# EAGLE design base-pcb (EAGLE 6.4)
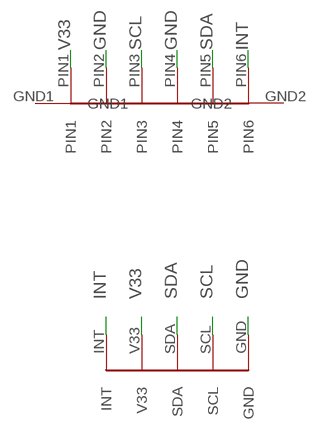
[diagram p0: schematic, sheet 1]

## Parts
POGO-1  POGOPINS  [POGOPINS]
U$1  6PCONNECTOR  [6PCONNECTOR]

## Nets
GND: POGO-1.GND U$1.PIN2 U$1.PIN4
INT: POGO-1.INT U$1.PIN6
SCL: POGO-1.SCL U$1.PIN3
SDA: POGO-1.SDA U$1.PIN5
V33: POGO-1.V33 U$1.PIN1
Unconnected: U$1.GND1 U$1.GND2

## Library data of the parts
POGO-1 = pogopins:POGOPINS
U$1 = 6Pconnector:6PCONNECTOR

## Board
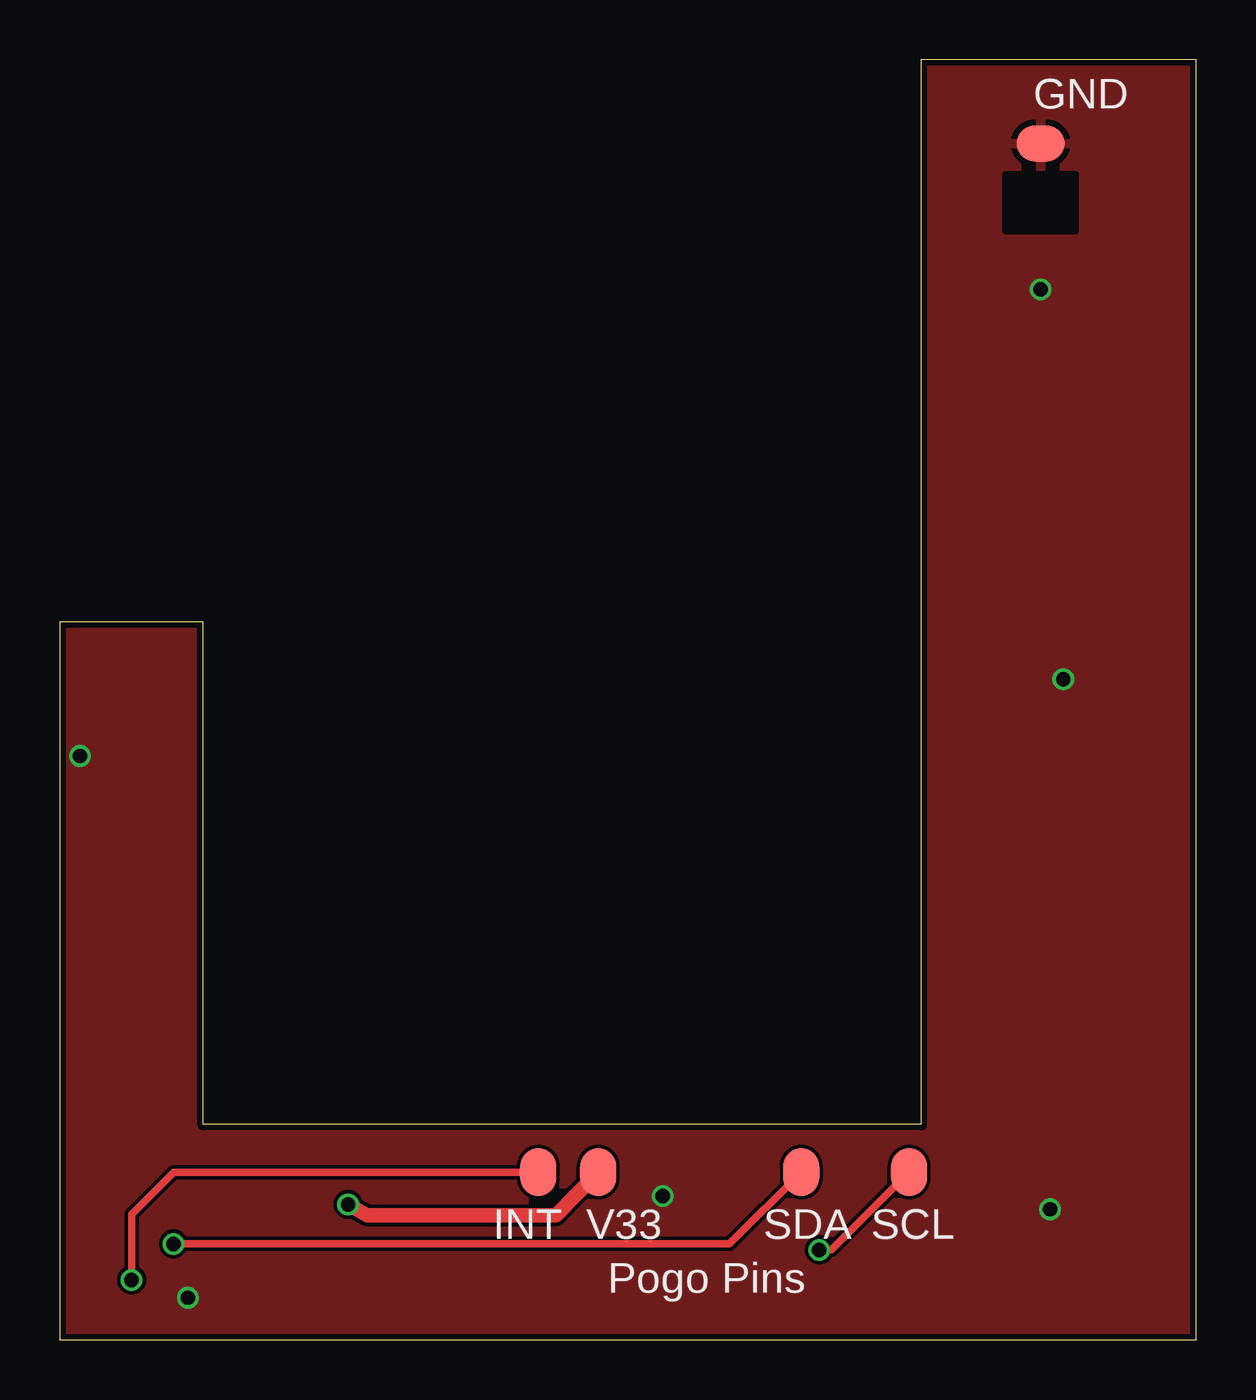
[diagram p1: board, top side]
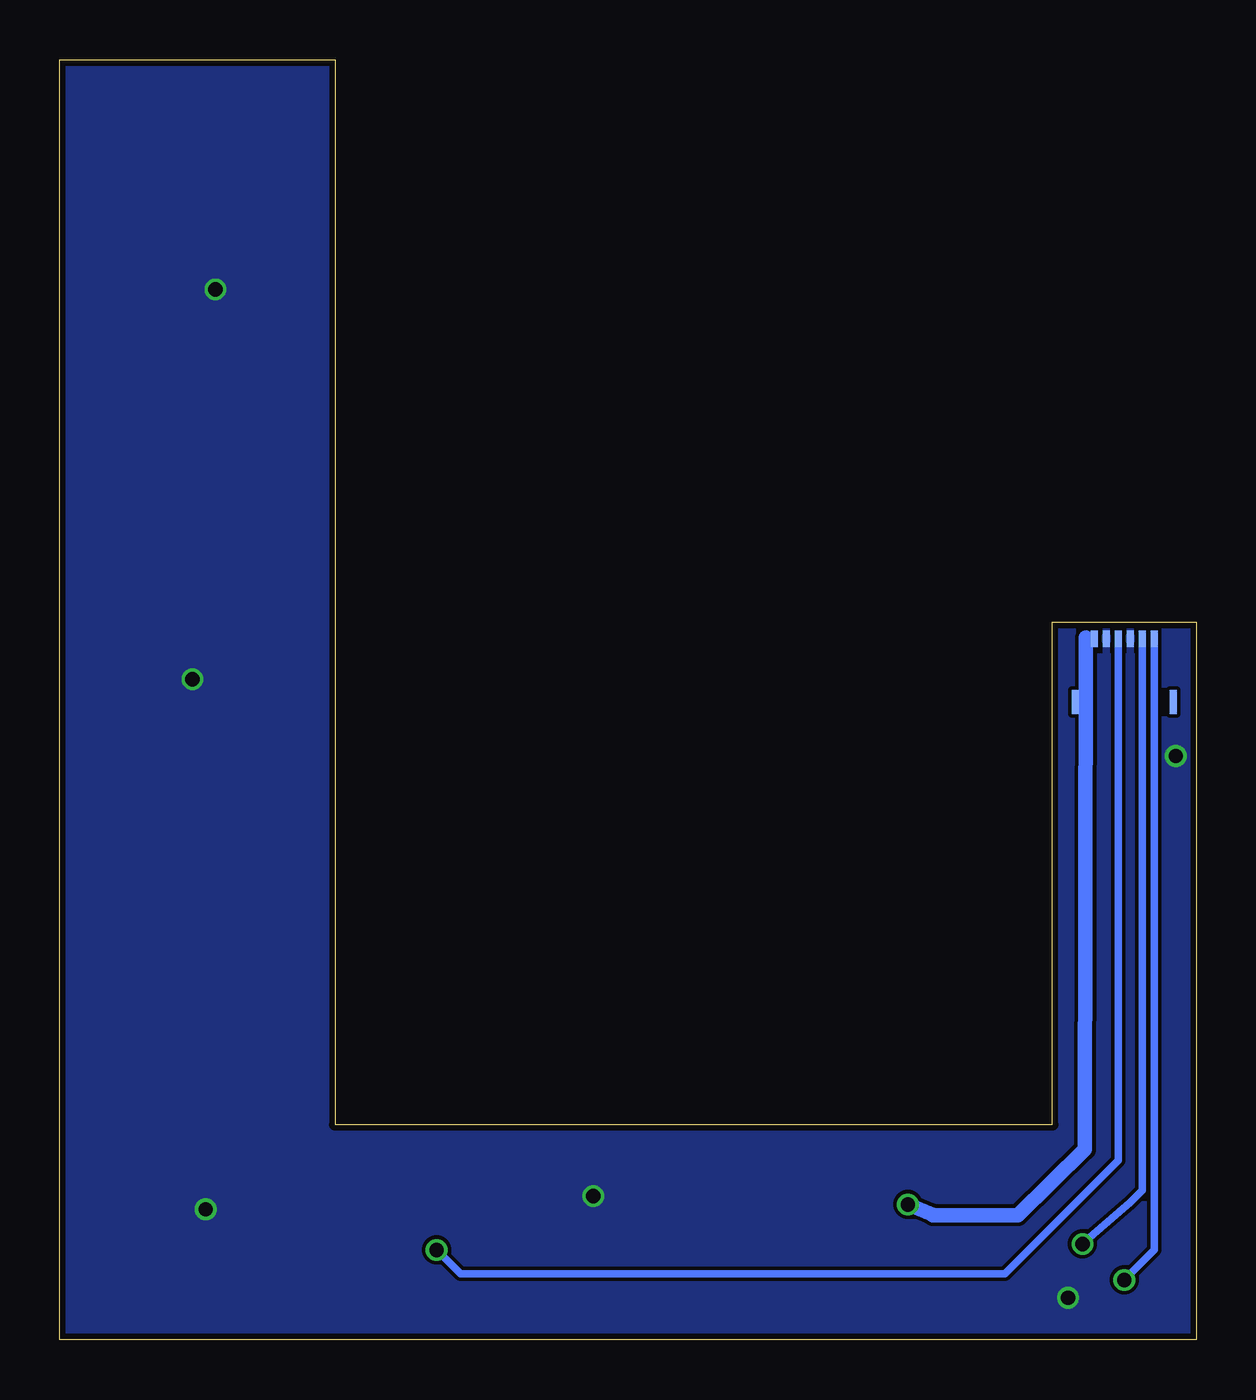
[diagram p2: board, bottom side, seen from below]

Size 47.5 x 53.5 mm. Coordinates in mm from the lower left corner, seen from the top.
Outline: 0,0 47.5,0 47.5,53.5 36,53.5 36,9 6,9 6,30 0,30 0,0
Copper layers (1*2*15*16): Top 0.035mm / dielectric 0.2mm / Route2 0.0175mm / dielectric 1.1mm / Route15 0.0175mm / dielectric 0.2mm / Bottom 0.035mm
Design rules "SeeedStudio_DRU_no_angle_20130527": minimum track width 6mil, minimum drill 12mil, track to track 6mil, track to pad 6mil, pad to pad 6mil, via to via 6mil, smd to smd 0mil, copper to edge 10mil, drill to drill 10mil, minimum pad ring 6mil, minimum via ring 6mil, stop-mask expansion 2mil, vias tented up to drill 25mil, thermal gap 10mil

### Footprints (pad centres in the part's own frame; a part is rotated, then mirrored left to right if it is on the bottom)
POGOPINS = smd 2 x 1.5: GND 13,43 | smd 1.5 x 2: INT -8,0; SCL 7.5,0; SDA 3,0; V33 -5.5,0
6PCONNECTOR = smd 0.3 x 1: GND1 -2.05,-2.3; GND2 2.05,-2.3 | smd 0.3 x 0.7: PIN1 -1.25,0.35; PIN2 -0.75,0.35; PIN3 -0.25,0.35; PIN4 0.25,0.35; PIN5 0.75,0.35; PIN6 1.25,0.35

### Placement (x,y rotation side)
POGO-1  28,7 0 top
U$1  3,28.95 0 bottom

### Tracks (layer width: path | path; a pad name or v marks a point on that pad's centre or on a via)
GND  (via drill 0.6)
  other vias: 41.4,5.45 25.2,6 0.85,24.4 41.95,27.6 41,43.9 5.35,1.75
  pour Top: 0,0 47.5,0 47.5,53.5 36,53.5 36,9 6,9 6,30 0,30
  pour Bottom: 0,0 47.5,0 47.5,53.5 36,53.5 36,9 6,9 6,30 0,30
INT  (via drill 0.6)
  Top 0.305: v3,2.5 3,5.25 4.75,7 POGO-1.INT
  Bottom 0.305: U$1.PIN6 1.75,3.75 v3,2.5
N$3
  cutout Top: 39.55,48.7 42.45,48.7 42.45,46.35 39.55,46.35
SCL  (via drill 0.6)
  Top 0.305: v31.75,3.75 32.25,3.75 POGO-1.SCL
  Bottom 0.305: U$1.PIN3 3.25,7.5 8,2.75 30.75,2.75 v31.75,3.75
SDA  (via drill 0.6)
  Top 0.305: v4.75,4 28,4 POGO-1.SDA
  Bottom 0.305: v4.75,4 2.75,5.75 2.25,6.25 U$1.PIN5
V33  (via drill 0.6)
  Top 0.305: 22.5,6.75 POGO-1.V33
  Top 0.61: v12.05,5.65 12.85,5.2 20.75,5.2 POGO-1.V33
  Bottom 0.305: U$1.PIN1 4.6,29.35
  Bottom 0.61: 4.6,29.35 4.65,7.95 7.45,5.2 11,5.2 11.05,5.25 v12.05,5.65